# Altium schematic sheet Overview.SchDoc
size A; SheetNumber: 1; SheetTotal: 4
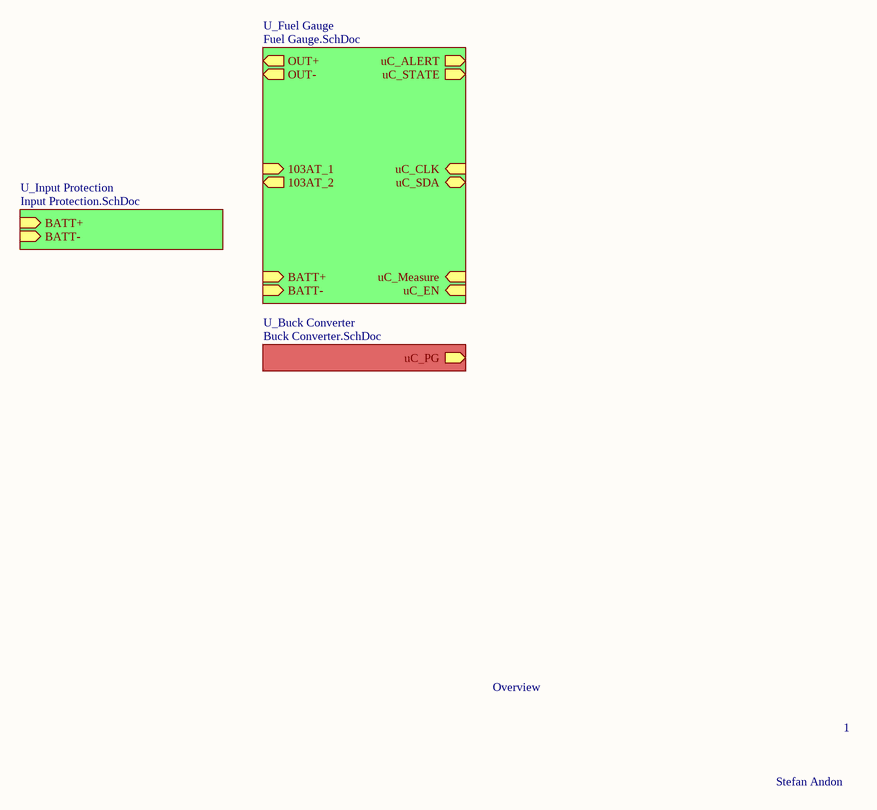
[diagram p0: Overview.SchDoc]

## Sub-sheets
U_Buck Converter = Buck Converter.SchDoc: uC_PG (out)
U_Fuel Gauge = Fuel Gauge.SchDoc: OUT- (out), BATT- (in), BATT+ (in), OUT+ (out), 103AT_1 (in), 103AT_2 (out), uC_ALERT (out), uC_STATE (out), uC_EN (in), uC_Measure (in), uC_SDA (bidir), uC_CLK (in)
U_Input Protection = Input Protection.SchDoc: BATT+ (in), BATT- (in)

## Notes on the sheet
- Overview
- 1
- Stefan Andon